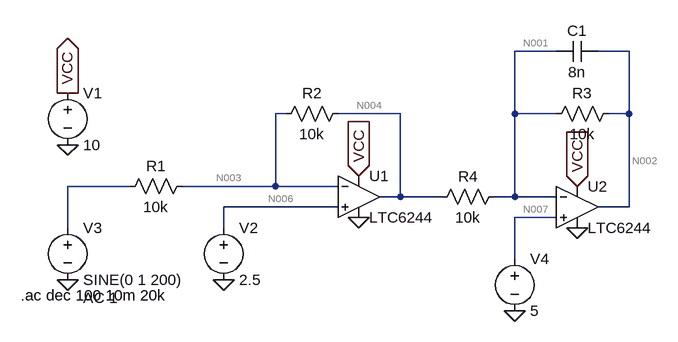
[diagram p0: schematic Input.asc]
Input.asc, the LTspice schematic file:
Version 4
SHEET 1 880 680
WIRE 672 -48 608 -48
WIRE 784 -48 736 -48
WIRE 256 48 240 48
WIRE 432 48 336 48
WIRE 608 48 608 -48
WIRE 672 48 608 48
WIRE 784 48 784 -48
WIRE 784 48 752 48
WIRE 16 160 -80 160
WIRE 240 160 240 48
WIRE 240 160 96 160
WIRE 336 160 240 160
WIRE 432 176 432 48
WIRE 432 176 400 176
WIRE 496 176 432 176
WIRE 608 176 608 48
WIRE 608 176 576 176
WIRE 672 176 608 176
WIRE 336 192 160 192
WIRE 784 192 784 48
WIRE 784 192 736 192
WIRE 672 208 608 208
WIRE -80 224 -80 160
WIRE 160 224 160 192
WIRE 608 272 608 208
FLAG 368 208 0
FLAG -80 96 0
FLAG -80 304 0
FLAG 160 304 0
FLAG -80 16 VCC
IOPIN -80 16 Out
FLAG 368 144 VCC
IOPIN 368 144 In
FLAG 704 224 0
FLAG 704 160 VCC
IOPIN 704 160 In
FLAG 608 352 0
SYMBOL Opamps\\LTC6244 368 176 R0
SYMATTR InstName U1
SYMBOL voltage -80 0 R0
WINDOW 123 0 0 Left 0
WINDOW 39 0 0 Left 0
SYMATTR InstName V1
SYMATTR Value 10
SYMBOL voltage 160 208 R0
WINDOW 123 0 0 Left 0
WINDOW 39 0 0 Left 0
SYMATTR InstName V2
SYMATTR Value 2.5
SYMBOL voltage -80 208 R0
WINDOW 123 24 124 Left 2
WINDOW 39 0 0 Left 0
SYMATTR Value2 AC 1
SYMATTR InstName V3
SYMATTR Value SINE(0 1 200)
SYMBOL res 112 144 R90
WINDOW 0 0 56 VBottom 2
WINDOW 3 32 56 VTop 2
SYMATTR InstName R1
SYMATTR Value 10k
SYMBOL res 352 32 R90
WINDOW 0 0 56 VBottom 2
WINDOW 3 32 56 VTop 2
SYMATTR InstName R2
SYMATTR Value 10k
SYMBOL Opamps\\LTC6244 704 192 R0
SYMATTR InstName U2
SYMBOL res 768 32 R90
WINDOW 0 0 56 VBottom 2
WINDOW 3 32 56 VTop 2
SYMATTR InstName R3
SYMATTR Value 10k
SYMBOL res 592 160 R90
WINDOW 0 0 56 VBottom 2
WINDOW 3 32 56 VTop 2
SYMATTR InstName R4
SYMATTR Value 10k
SYMBOL cap 736 -64 R90
WINDOW 0 0 32 VBottom 2
WINDOW 3 32 32 VTop 2
SYMATTR InstName C1
SYMATTR Value 8n
SYMBOL voltage 608 256 R0
WINDOW 123 0 0 Left 0
WINDOW 39 0 0 Left 0
SYMATTR InstName V4
SYMATTR Value 5
TEXT -152 328 Left 2 !.ac dec 100 10m 20k

The netlist it stands for:
* Input.asc
XU1 N006 N003 VCC 0 N004 LTC6244  ; pins In+ In- V+ V- OUT
V1 VCC 0 10
V2 N006 0 2.5
V3 N005 0 SINE(0 1 200) AC 1
R1 N003 N005 10k
R2 N004 N003 10k
XU2 N007 N001 VCC 0 N002 LTC6244  ; pins In+ In- V+ V- OUT
R3 N002 N001 10k
R4 N001 N004 10k
C1 N002 N001 8n
V4 N007 0 5
.ac dec 100 10m 20k
.backanno
.end

* Results of the author's LTspice run, read from the files saved beside the schematic
* Operating Point, zero values left out:
*   V(n003) = 2.5 V
*   V(n006) = 2.5 V
*   V(vcc) = 10 V
*   V(n004) = 5 V
*   V(n001) = 5 V
*   V(n007) = 5 V
*   V(n002) = 5 V
*   I(R4) = 2.395 pA
*   I(R3) = 2.395 pA
*   I(R2) = 250 µA
*   I(R1) = 250 µA
*   I(V3) = 250 µA
*   I(V1) = -11.7 mA
*   Ix(u1:3) = 5.914 mA
*   Ix(u1:4) = -5.664 mA
*   Ix(u1:5) = -250 µA
*   Ix(u2:3) = 5.788 mA
*   Ix(u2:4) = -5.788 mA
*   Ix(u2:5) = -2.395 pA
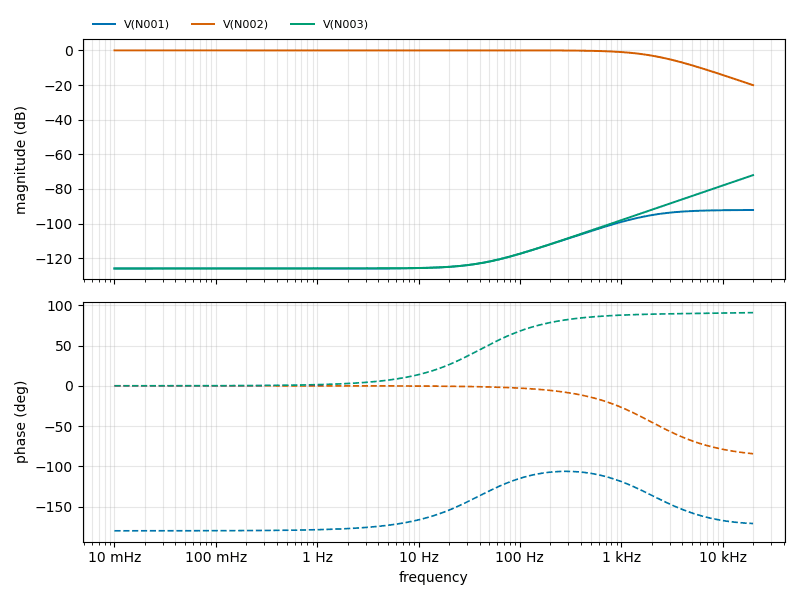
[diagram p1: AC Analysis of Input.asc, plotted from the saved traces]
* AC Analysis, 1 run:
*   V(N001): -125.94 dB at 10 mHz, -92.14 dB at 20 kHz, peak -92.14 dB at 20 kHz, 3 dB below the peak at 1.974 kHz
*   V(N002): -0.00 dB at 10 mHz, -20.09 dB at 20 kHz, peak -0.00 dB at 10 mHz, 3 dB below the peak at 1.989 kHz
*   V(N003): -125.90 dB at 10 mHz, -72.02 dB at 20 kHz, peak -72.02 dB at 20 kHz, 3 dB below the peak at 14.14 kHz